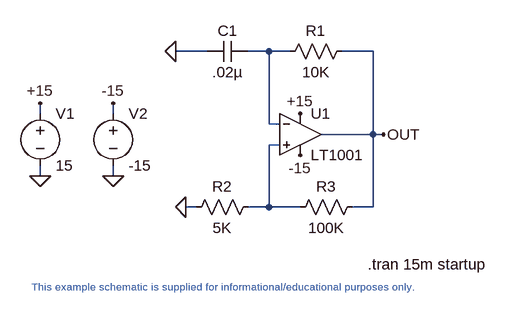
[diagram p0: schematic relax.asc]
relax.asc, the LTspice schematic file:
Version 4
SHEET 1 1464 1616
WIRE 976 1120 928 1120
WIRE 1072 1120 1040 1120
WIRE 1104 1120 1072 1120
WIRE 1232 1120 1184 1120
WIRE 720 1216 720 1200
WIRE 832 1216 832 1200
WIRE 1072 1232 1072 1120
WIRE 1088 1232 1072 1232
WIRE 1232 1248 1232 1120
WIRE 1232 1248 1152 1248
WIRE 1248 1248 1232 1248
WIRE 1088 1264 1072 1264
WIRE 720 1312 720 1296
WIRE 832 1312 832 1296
WIRE 960 1360 944 1360
WIRE 1072 1360 1072 1264
WIRE 1072 1360 1040 1360
WIRE 1120 1360 1072 1360
WIRE 1232 1360 1232 1248
WIRE 1232 1360 1200 1360
FLAG 928 1120 0
FLAG 720 1312 0
FLAG 832 1312 0
FLAG 1248 1248 OUT
FLAG 944 1360 0
FLAG 1120 1216 +15
FLAG 720 1200 +15
FLAG 832 1200 -15
FLAG 1120 1280 -15
SYMBOL res 1200 1104 R90
WINDOW 0 0 56 VBottom 2
WINDOW 3 32 56 VTop 2
SYMATTR InstName R1
SYMATTR Value 10K
SYMBOL voltage 720 1200 R0
SYMATTR InstName V1
SYMATTR Value 15
SYMBOL voltage 832 1200 R0
SYMATTR InstName V2
SYMATTR Value -15
SYMBOL res 1056 1344 R90
WINDOW 0 0 56 VBottom 2
WINDOW 3 32 56 VTop 2
SYMATTR InstName R2
SYMATTR Value 5K
SYMBOL cap 1040 1104 R90
WINDOW 0 0 32 VBottom 2
WINDOW 3 32 32 VTop 2
SYMATTR InstName C1
SYMATTR Value .02µ
SYMBOL res 1216 1344 R90
WINDOW 0 0 56 VBottom 2
WINDOW 3 32 56 VTop 2
SYMATTR InstName R3
SYMATTR Value 100K
SYMBOL opamps\\LT1001 1120 1184 R0
SYMATTR InstName U1
TEXT 1224 1448 Left 2 !.tran 15m startup
TEXT 992 1472 Top 1 ;This example schematic is supplied for informational/educational purposes only.

The netlist it stands for:
* relax.asc
R1 OUT N001 10K
V1 +15 0 15
V2 -15 0 -15
R2 N002 0 5K
C1 N001 0 .02µ
R3 OUT N002 100K
XU1 N002 N001 +15 -15 OUT LT1001  ; pins In+ In- V+ V- OUT
.tran 15m startup
* This example schematic is supplied for informational/educational purposes only.
.lib LTC.lib
.backanno
.end